# Altium schematic sheet rp3a-mini-power.SchDoc
size A4; SheetNumber: 2; SheetTotal: 6
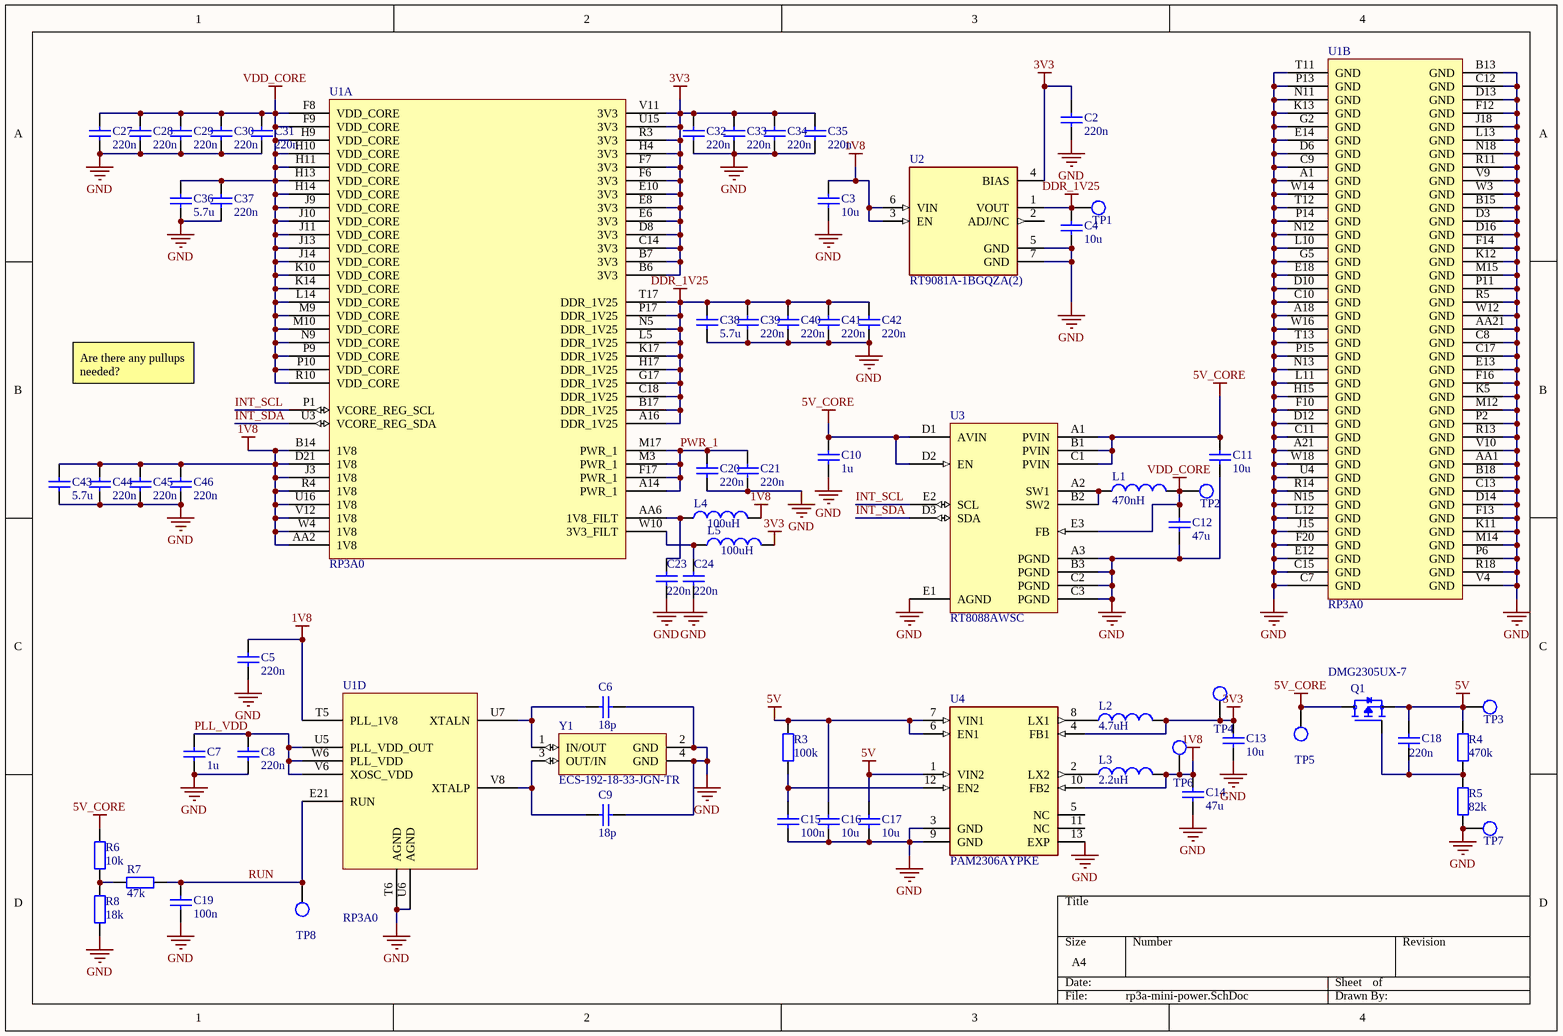
[diagram p0: rp3a-mini-power.SchDoc]

## Parts
C2  value 220n  [0402]  (hidden comment: Cap)
C3  value 10u  [0603]  (hidden comment: Cap)
C4  value 10u  [0603]  (hidden comment: Cap)
C5  value 220n  [0402]  (hidden comment: Cap)
C6  value 18p  [0402]  (hidden comment: Cap)
C7  value 1u  [0402]  (hidden comment: Cap)
C8  value 220n  [0402]  (hidden comment: Cap)
C9  value 18p  [0402]  (hidden comment: Cap)
C10  value 1u  [0402]  (hidden comment: Cap)
C11  value 10u  [0603]  (hidden comment: Cap)
C12  value 47u  [C0805 NP]  (hidden comment: Cap)
C13  value 10u  [0603]  (hidden comment: Cap)
C14  value 47u  [C0805 NP]  (hidden comment: Cap)
C15  value 100n  [0402]  (hidden comment: Cap)
C16  value 10u  [0603]  (hidden comment: Cap)
C17  value 10u  [0603]  (hidden comment: Cap)
C18  value 220n  [0402]  (hidden comment: Cap)
C19  value 100n  [0402]  (hidden comment: Cap)
C20  value 220n  [0402]  (hidden comment: Cap)
C21  value 220n  [0402]  (hidden comment: Cap)
C23  value 220n  [0402]  (hidden comment: Cap)
C24  value 220n  [0402]  (hidden comment: Cap)
C27  value 220n  [0402]  (hidden comment: Cap)
C28  value 220n  [0402]  (hidden comment: Cap)
C29  value 220n  [0402]  (hidden comment: Cap)
C30  value 220n  [0402]  (hidden comment: Cap)
C31  value 220n  [0402]  (hidden comment: Cap)
C32  value 220n  [0402]  (hidden comment: Cap)
C33  value 220n  [0402]  (hidden comment: Cap)
C34  value 220n  [0402]  (hidden comment: Cap)
C35  value 220n  [0402]  (hidden comment: Cap)
C36  value 5.7u  [0603]  (hidden comment: Cap)
C37  value 220n  [0402]  (hidden comment: Cap)
C38  value 5.7u  [0603]  (hidden comment: Cap)
C39  value 220n  [0402]  (hidden comment: Cap)
C40  value 220n  [0402]  (hidden comment: Cap)
C41  value 220n  [0402]  (hidden comment: Cap)
C42  value 220n  [0402]  (hidden comment: Cap)
C43  value 5.7u  [0603]  (hidden comment: Cap)
C44  value 220n  [0402]  (hidden comment: Cap)
C45  value 220n  [0402]  (hidden comment: Cap)
C46  value 220n  [0402]  (hidden comment: Cap)
L1  value 470nH  [INDC2016X100N]  (hidden comment: INDUCTOR)
L2  value 4.7uH  [INDP4040X180N]  (hidden comment: INDUCTOR)
L3  value 2.2uH  [INDP2622X120N]  (hidden comment: INDUCTOR)
L4  value 100uH  [0402]  (hidden comment: INDUCTOR)
L5  value 100uH  [0402]  (hidden comment: INDUCTOR)
Q1  DMG2305UX-7  [SOT91P240X110-3N_DMG2305UX-7]
R3  value 100k  [RES-0402-SML]  (hidden comment: Res SMD)
R4  value 470k  [RES-0402-SML]  (hidden comment: Res SMD)
R5  value 82k  [RES-0402-SML]  (hidden comment: Res SMD)
R6  value 10k  [RES-0402-SML]  (hidden comment: Res SMD)
R7  value 47k  [RES-0402-SML]  (hidden comment: Res SMD)
R8  value 18k  [RES-0402-SML]  (hidden comment: Res SMD)
TP1  TEST_POINT  [TEST_POINT_1.2MM]  (value not drawn)
TP2  TEST_POINT  [TEST_POINT_1.2MM]  (value not drawn)
TP3  TEST_POINT  [TEST_POINT_1.2MM]  (value not drawn)
TP4  TEST_POINT  [TEST_POINT_1.2MM]  (value not drawn)
TP5  TEST_POINT  [TEST_POINT_1.2MM]  (value not drawn)
TP6  TEST_POINT  [TEST_POINT_1.2MM]  (value not drawn)
TP7  TEST_POINT  [TEST_POINT_1.2MM]  (value not drawn)
TP8  TEST_POINT  [TEST_POINT_1.2MM]  (value not drawn)
U1  RP3A0  [RP3A0-BGA]  (parts A,B,D of 8)
U2  RT9081A-1BGQZA(2)  [VREG_RT9081A_1BGQZA(2)]
U3  RT8088AWSC  [15B_WLCSP_1.31x2.11]
U4  PAM2306AYPKE  [SON45P300X300X80-13N]
Y1  ECS-192-18-33-JGN-TR  [XTAL_ECS-192-18-33-JGN-TR]

## Nets
1V8: C3.2 C5.2 C14.2 C43.2 C44.2 C45.2 C46.2 L3.2 L4.2 TP6.TP U1.AA2(1V8) U1.B14(1V8) U1.D21(1V8) U1.J3(1V8) U1.R4(1V8) U1.T5(PLL_1V8) U1.U16(1V8) U1.V12(1V8) U1.W4(1V8) U2.3(EN) U2.6(VIN) U4.10(FB2)
3V3: C2.2 C13.2 C32.2 C33.2 C34.2 C35.2 L2.2 L5.2 TP4.TP U1.B6(3V3) U1.B7(3V3) U1.C14(3V3) U1.D8(3V3) U1.E6(3V3) U1.E8(3V3) U1.E10(3V3) U1.F6(3V3) U1.F7(3V3) U1.H4(3V3) U1.R3(3V3) U1.U15(3V3) U1.V11(3V3) U2.4(BIAS) U4.4(FB1)
5V: C16.2 C17.2 C18.2 Q1.2(S) R3.2 R4.2 TP3.TP U4.1(VIN2) U4.6(EN1) U4.7(VIN1)
5V_CORE: C10.2 C11.2 Q1.3(D) R6.2 TP5.TP U3.A1(PVIN) U3.B1(PVIN) U3.C1(PVIN) U3.D1(AVIN) U3.D2(EN)
DDR_1V25: C4.2 C38.2 C39.2 C40.2 C41.2 C42.2 TP1.TP U1.A16(DDR_1V25) U1.B17(DDR_1V25) U1.C18(DDR_1V25) U1.G17(DDR_1V25) U1.H17(DDR_1V25) U1.K17(DDR_1V25) U1.L5(DDR_1V25) U1.N5(DDR_1V25) U1.P17(DDR_1V25) U1.T17(DDR_1V25) U2.1(VOUT)
GND: C2.1 C3.1 C4.1 C5.1 C6.2 C7.1 C8.1 C9.2 C10.1 C11.1 C12.1 C13.1 C14.1 C15.1 C16.1 C17.1 C19.1 C20.1 C21.1 C23.1 C24.1 C27.1 C28.1 C29.1 C30.1 C31.1 C32.1 C33.1 C34.1 C35.1 C36.1 C37.1 C38.1 C39.1 C40.1 C41.1 C42.1 C43.1 C44.1 C45.1 C46.1 R5.2 R8.1 TP7.TP U1.A1(GND) U1.A18(GND) U1.A21(GND) U1.AA1(GND) U1.AA21(GND) U1.B13(GND) U1.B15(GND) U1.B18(GND) U1.C7(GND) U1.C8(GND) U1.C9(GND) U1.C10(GND) U1.C11(GND) U1.C12(GND) U1.C13(GND) U1.C15(GND) U1.C17(GND) U1.D3(GND) U1.D6(GND) U1.D10(GND) U1.D12(GND) U1.D13(GND) U1.D14(GND) U1.D16(GND) U1.E12(GND) U1.E13(GND) U1.E14(GND) U1.E18(GND) U1.F10(GND) U1.F12(GND) U1.F13(GND) U1.F14(GND) U1.F16(GND) U1.F20(GND) U1.G2(GND) U1.G5(GND) U1.H15(GND) U1.J15(GND) U1.J18(GND) U1.K5(GND) U1.K11(GND) U1.K12(GND) U1.K13(GND) U1.L10(GND) U1.L11(GND) U1.L12(GND) U1.L13(GND) U1.M12(GND) U1.M14(GND) U1.M15(GND) U1.N11(GND) U1.N12(GND) U1.N13(GND) U1.N15(GND) U1.N18(GND) U1.P2(GND) U1.P6(GND) U1.P11(GND) U1.P13(GND) U1.P14(GND) U1.P15(GND) U1.R5(GND) U1.R11(GND) U1.R13(GND) U1.R14(GND) U1.R18(GND) U1.T6(AGND) U1.T11(GND) U1.T12(GND) U1.T13(GND) U1.U4(GND) U1.U6(AGND) U1.V4(GND) U1.V9(GND) U1.V10(GND) U1.W3(GND) U1.W12(GND) U1.W14(GND) U1.W16(GND) U1.W18(GND) U2.5(GND) U2.7(GND) U3.A3(PGND) U3.B3(PGND) U3.C2(PGND) U3.C3(PGND) U3.E1(AGND) U4.3(GND) U4.9(GND) U4.13(EXP) Y1.2(GND) Y1.4(GND)
VDD_CORE: C12.2 C27.2 C28.2 C29.2 C30.2 C31.2 C36.2 C37.2 L1.2 TP2.TP U1.F8(VDD_CORE) U1.F9(VDD_CORE) U1.H9(VDD_CORE) U1.H10(VDD_CORE) U1.H11(VDD_CORE) U1.H13(VDD_CORE) U1.H14(VDD_CORE) U1.J9(VDD_CORE) U1.J10(VDD_CORE) U1.J11(VDD_CORE) U1.J13(VDD_CORE) U1.J14(VDD_CORE) U1.K10(VDD_CORE) U1.K14(VDD_CORE) U1.L14(VDD_CORE) U1.M9(VDD_CORE) U1.M10(VDD_CORE) U1.N9(VDD_CORE) U1.P9(VDD_CORE) U1.P10(VDD_CORE) U1.R10(VDD_CORE) U3.E3(FB)
INT_SCL: U1.P1(VCORE_REG_SCL) U3.E2(SCL)
INT_SDA: U1.U3(VCORE_REG_SDA) U3.D3(SDA)
PLL_VDD: C7.2 C8.2 U1.U5(PLL_VDD_OUT) U1.V6(XOSC_VDD) U1.W6(PLL_VDD)
PWR_1: C20.2 C21.2 U1.A14(PWR_1) U1.F17(PWR_1) U1.M3(PWR_1) U1.M17(PWR_1)
RUN: C19.2 R7.2 TP8.TP U1.E21(RUN)
NetC6_1: C6.1 U1.U7(XTALN) Y1.1(IN/OUT)
NetC9_1: C9.1 U1.V8(XTALP) Y1.3(OUT/IN)
NetC15_2: C15.2 R3.1 U4.12(EN2)
NetC18_1: C18.1 Q1.1(G) R4.1 R5.1
NetC23_2: C23.2 L4.1 U1.AA6(1V8_FILT)
NetC24_2: C24.2 L5.1 U1.W10(3V3_FILT)
NetL1_1: L1.1 U3.A2(SW1) U3.B2(SW2)
NetL2_1: L2.1 U4.8(LX1)
NetL3_1: L3.1 U4.2(LX2)
NetR6_1: R6.1 R7.1 R8.2

Not connected (* = marked no-connect by the designer): U2 2(ADJ/NC); U4 5(NC) 11(NC)

## Notes on the sheet
- Are there any pullups needed?

## Library data of the parts
C2-C21 C23 C24 C27-C46 = CAP-NONPOL: Capacitor
L1-L5 = INDUCTOR: Inductor SMD
Q1 = DMG2305UX-7: P-Channel 20V 4.2A _Ta_ 1.4W _Ta_ Surface Mount SOT-23; MF: Power Analog Micro; SnapEDA_Link: https://www.snapeda.com/parts/DMG2305UX-7/Power%20Analog%20Micro/view-part/174848/?ref=snap; Price: None; MP: DMG2305UX-7; Package: TO-236-3 Power Analog Micro; Value: *; Availability: Unavailable
R3-R8 = Res SMD: Resistor
TP1-TP8 = TEST_POINT: Test point
U2 = RT9081A-1BGQZA(2): Linear Voltage Regulator IC 1 Output 500mA 6-ZADFN (1.2x1.2); MP: RT9081AGQZA; MF: Richtek USA; Value: *; Package: XFDFN-6 Richtek; Availability: In Stock; Check_prices: https://www.snapeda.com/parts/RT9081AGQZA/Richtek+USA+Inc./view-part/?ref=eda; SnapEDA_Link: https://www.snapeda.com/parts/RT9081AGQZA/Richtek+USA+Inc./view-part/?ref=snap; Price: None
U3 = RT8088AWSC: Buck Switching Regulator IC Positive Programmable 0.6V 1 Output 3A 15-UFBGA, WLCSP
U4 = PAM2306AYPKE: Buck Switching Regulator IC Positive Fixed 1.8V, 3.3V 2 Output 1A 12-WFDFN Exposed Pad; MF: Diodes Inc.; Value: *; MP: PAM2306AYPKE; Package: WFDFN-12 Diodes Inc.; Price: None; SnapEDA_Link: https://www.snapeda.com/parts/PAM2306AYPKE/Diodes%20Inc./view-part/481908/?ref=snap; Availability: Unavailable
Y1 = ECS-192-18-33-JGN-TR: The sub miniature ECX-32 is a compact SMD Crystal. The 3.2 x 2.5 x 0.8 mm ceramic package is ideal for todayâ€™s SMD manufacturing environment.; Package: None; Price: None; Value: *; MP: ECS-192-18-33-JGN-TR; Availability: Unavailable